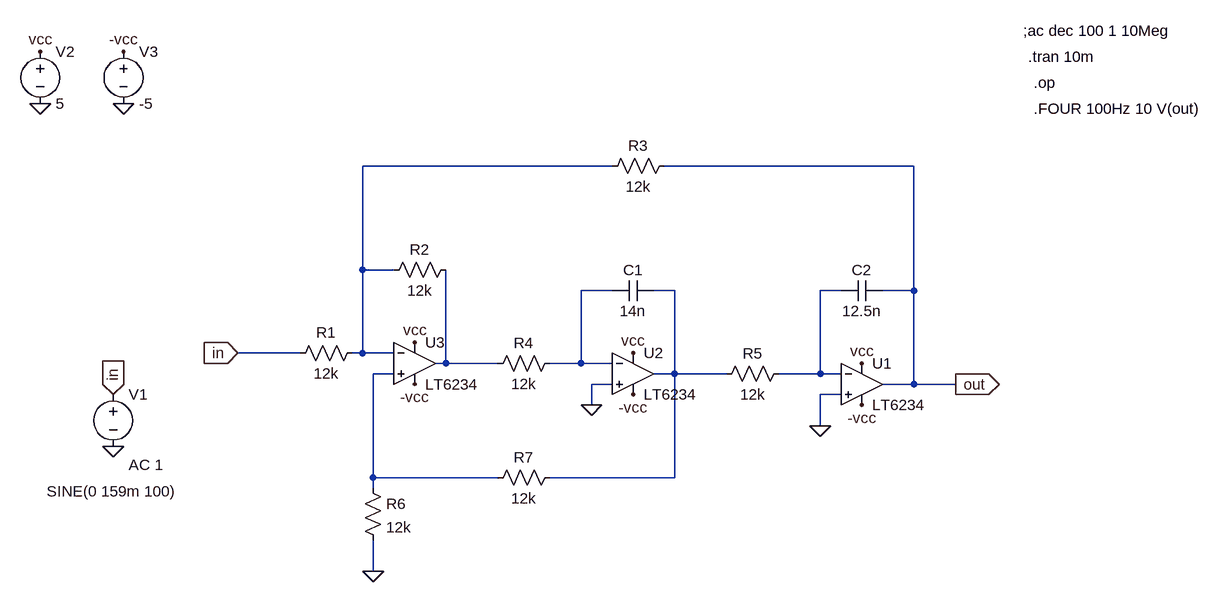
[diagram p0: schematic Etaj2.asc]
Etaj2.asc, the LTspice schematic file:
Version 4
SHEET 1 880 680
WIRE -64 -144 -448 -144
WIRE 400 -144 16 -144
WIRE -448 16 -448 -144
WIRE -400 16 -448 16
WIRE -64 48 -112 48
WIRE 32 48 0 48
WIRE 288 48 256 48
WIRE 400 48 400 -144
WIRE 400 48 352 48
WIRE -544 144 -640 144
WIRE -448 144 -448 16
WIRE -448 144 -464 144
WIRE -400 144 -448 144
WIRE -320 160 -320 16
WIRE -320 160 -336 160
WIRE -240 160 -320 160
WIRE -112 160 -112 48
WIRE -112 160 -160 160
WIRE -64 160 -112 160
WIRE -400 176 -432 176
WIRE 32 176 32 48
WIRE 32 176 0 176
WIRE 112 176 32 176
WIRE 256 176 256 48
WIRE 256 176 192 176
WIRE 288 176 256 176
WIRE -64 192 -96 192
WIRE 400 192 400 48
WIRE 400 192 352 192
WIRE 464 192 400 192
WIRE 288 208 256 208
WIRE -96 224 -96 192
WIRE 256 256 256 208
WIRE -432 336 -432 176
WIRE -240 336 -432 336
WIRE 32 336 32 176
WIRE 32 336 -160 336
WIRE -432 352 -432 336
WIRE -432 480 -432 432
FLAG 256 256 0
FLAG -96 224 0
FLAG -432 480 0
FLAG -832 288 0
FLAG -944 -240 0
FLAG -816 -240 0
FLAG -944 -320 vcc
FLAG -368 128 vcc
FLAG -32 144 vcc
FLAG 320 160 vcc
FLAG -816 -320 -vcc
FLAG -368 192 -vcc
FLAG -32 208 -vcc
FLAG 320 224 -vcc
FLAG -832 208 in
IOPIN -832 208 In
FLAG -640 144 in
IOPIN -640 144 In
FLAG 464 192 out
IOPIN 464 192 Out
SYMBOL OpAmps\\LT6234 320 192 R0
SYMATTR InstName U1
SYMBOL OpAmps\\LT6234 -32 176 R0
SYMATTR InstName U2
SYMBOL OpAmps\\LT6234 -368 160 R0
SYMATTR InstName U3
SYMBOL cap 0 32 R90
WINDOW 0 0 32 VBottom 2
WINDOW 3 32 32 VTop 2
SYMATTR InstName C1
SYMATTR Value 14n
SYMBOL cap 352 32 R90
WINDOW 0 0 32 VBottom 2
WINDOW 3 32 32 VTop 2
SYMATTR InstName C2
SYMATTR Value 12.5n
SYMBOL res -144 144 R90
WINDOW 0 0 56 VBottom 2
WINDOW 3 32 56 VTop 2
SYMATTR InstName R4
SYMATTR Value 12k
SYMBOL res 208 160 R90
WINDOW 0 0 56 VBottom 2
WINDOW 3 32 56 VTop 2
SYMATTR InstName R5
SYMATTR Value 12k
SYMBOL res -144 320 R90
WINDOW 0 0 56 VBottom 2
WINDOW 3 32 56 VTop 2
SYMATTR InstName R7
SYMATTR Value 12k
SYMBOL res -448 128 R90
WINDOW 0 0 56 VBottom 2
WINDOW 3 32 56 VTop 2
SYMATTR InstName R1
SYMATTR Value 12k
SYMBOL res 32 -160 R90
WINDOW 0 0 56 VBottom 2
WINDOW 3 32 56 VTop 2
SYMATTR InstName R3
SYMATTR Value 12k
SYMBOL res -448 336 R0
SYMATTR InstName R6
SYMATTR Value 12k
SYMBOL res -304 0 R90
WINDOW 0 0 56 VBottom 2
WINDOW 3 32 56 VTop 2
SYMATTR InstName R2
SYMATTR Value 12k
SYMBOL voltage -832 192 R0
WINDOW 3 -102 165 Left 2
WINDOW 123 24 124 Left 2
WINDOW 39 0 0 Left 0
SYMATTR Value SINE(0 159m 100)
SYMATTR Value2 AC 1
SYMATTR InstName V1
SYMBOL voltage -944 -336 R0
WINDOW 123 0 0 Left 0
WINDOW 39 0 0 Left 0
SYMATTR InstName V2
SYMATTR Value 5
SYMBOL voltage -816 -336 R0
WINDOW 123 0 0 Left 0
WINDOW 39 0 0 Left 0
SYMATTR InstName V3
SYMATTR Value -5
TEXT 568 -352 Left 2 !;ac dec 100 1 10Meg
TEXT 576 -312 Left 2 !.tran 10m
TEXT 584 -272 Left 2 !.op
TEXT 584 -232 Left 2 !.FOUR 100Hz 10 V(out)

The netlist it stands for:
* Etaj2.asc
* U1: LT6234 (symbol OpAmps\LT6234 not available, pins judged from their places): In+=0 In-=N004 V+=vcc V-=-vcc OUT=out
* U2: LT6234 (symbol OpAmps\LT6234 not available, pins judged from their places): In+=0 In-=N002 V+=vcc V-=-vcc OUT=N003
* U3: LT6234 (symbol OpAmps\LT6234 not available, pins judged from their places): In+=N006 In-=N001 V+=vcc V-=-vcc OUT=N005
C1 N003 N002 14n
C2 out N004 12.5n
R4 N002 N005 12k
R5 N004 N003 12k
R7 N003 N006 12k
R1 N001 in 12k
R3 out N001 12k
R6 N006 0 12k
R2 N005 N001 12k
V1 in 0 SINE(0 159m 100) AC 1
V2 vcc 0 5
V3 -vcc 0 -5
;ac dec 100 1 10Meg
.tran 10m
.op
.FOUR 100Hz 10 V(out)
.backanno
.end